# Altium schematic sheet Sheet1.SchDoc: Плата оконечного устройства
size 420 x 297 mm; ApprovedBy: Алексеев; CheckedBy: Богданов; Author: Пятиренко; DrawnBy: Пятиренко; DocumentNumber: ЭАЕСН.464512.003Э3; SheetNumber: 1; SheetTotal: 6; PERVICH PRIM: ЭАЕСН.464512.003; Title2: Схема электрическая принципиальная; DocumentName: Sheet1.SCHDOC; Application_BuildNumber: sdfsdfsdfsdfsdfs
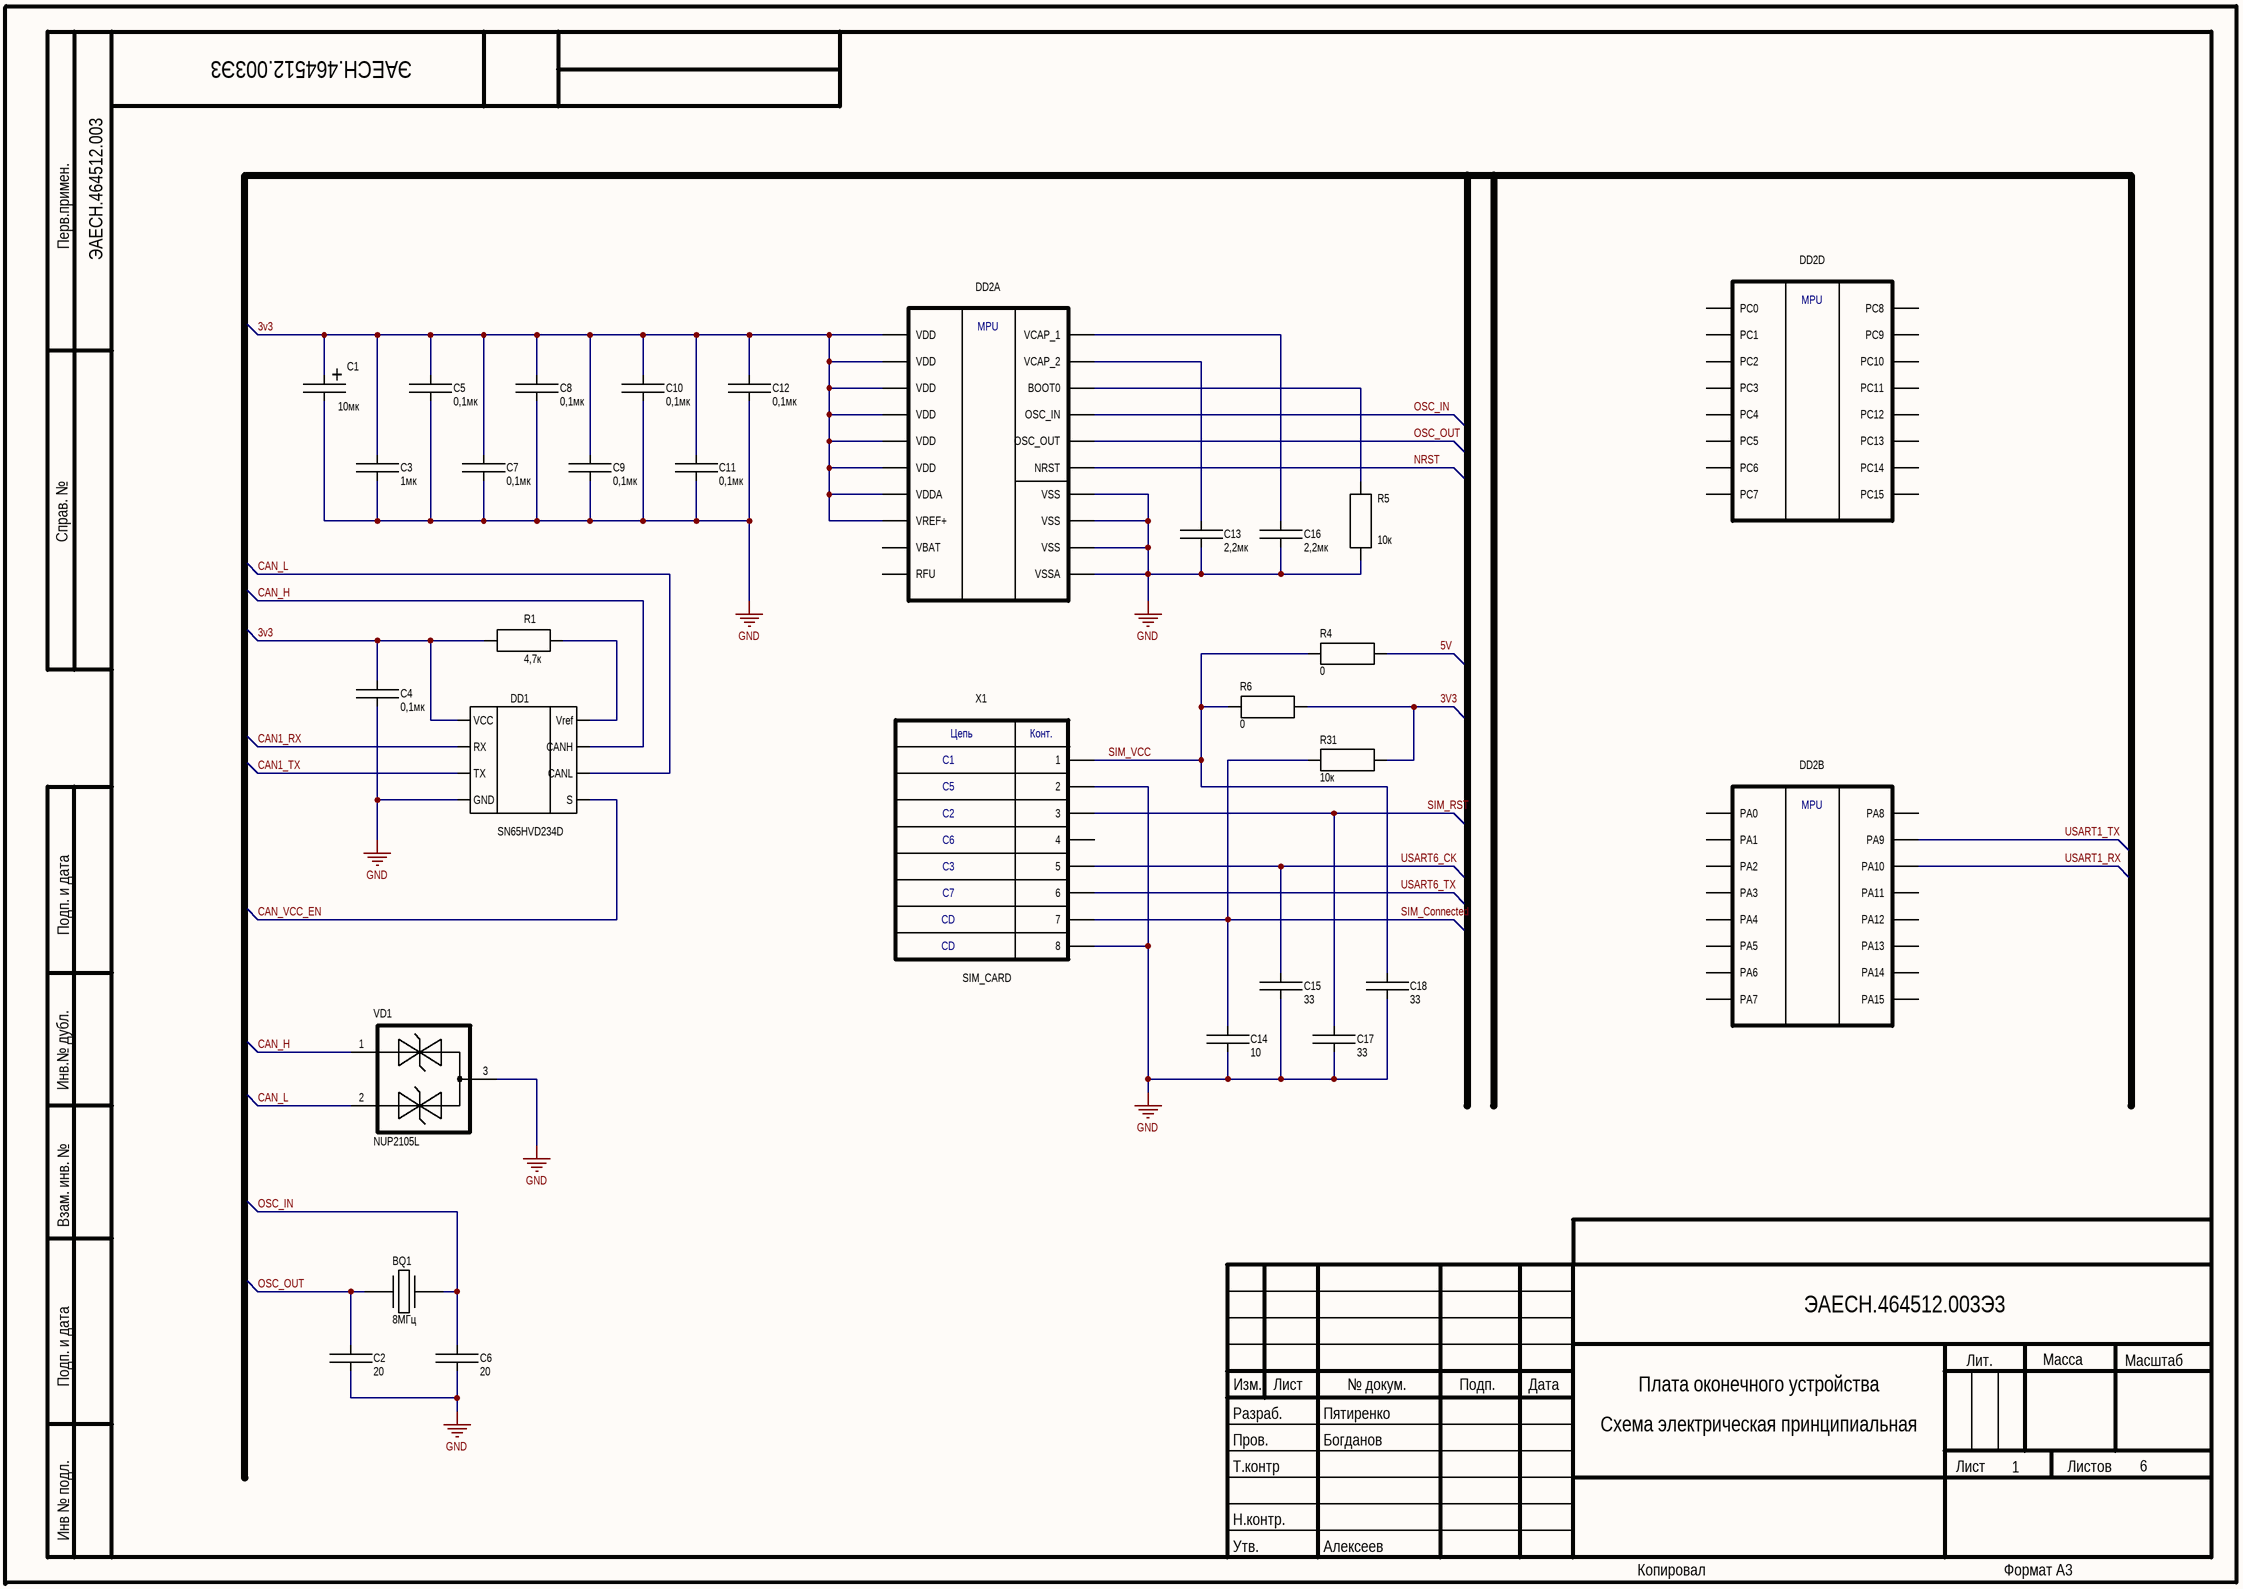
[diagram p0: Sheet1.SchDoc]

## Parts
BQ1  value 8МГц  [Crystal_0532]  (hidden comment: Quarz)
C1  value 10мк  [Case A]  (hidden comment: C_el)
C2  value 20  [С0603]  (hidden comment: C)
C3  value 1мк  [С0603]  (hidden comment: C)
C4  value 0,1мк  [С0603]  (hidden comment: C)
C5  value 0,1мк  [С0603]  (hidden comment: C)
C6  value 20  [С0603]  (hidden comment: C)
C7  value 0,1мк  [С0603]  (hidden comment: C)
C8  value 0,1мк  [С0603]  (hidden comment: C)
C9  value 0,1мк  [С0603]  (hidden comment: C)
C10  value 0,1мк  [С0603]  (hidden comment: C)
C11  value 0,1мк  [С0603]  (hidden comment: C)
C12  value 0,1мк  [С0603]  (hidden comment: C)
C13  value 2,2мк  [С0603]  (hidden comment: C)
C14  value 10  [С0603]  (hidden comment: C)
C15  value 33  [С0603]  (hidden comment: C)
C16  value 2,2мк  [С0603]  (hidden comment: C)
C17  value 33  [С0603]  (hidden comment: C)
C18  value 33  [С0603]  (hidden comment: C)
DD1  SN65HVD234D  [SOIC8]
DD2  STM32F207VCTx  [LQFP100]  (value not drawn)  (parts A,B,D of 6)
R1  value 4,7к  [R0603]  (hidden comment: R)
R4  value 0  [R0603]  (hidden comment: R)
R5  value 10к  [R0603]  (hidden comment: R)
R6  value 0  [R0603]  (hidden comment: R)
R31  value 10к  [R0603]  (hidden comment: R)
VD1  NUP2105L  [SOT-23]
X1  SIM_CARD  [SIM_CARD_READER2]

## Nets
GND: C1.2 C2.2 C3.2 C4.2 C5.2 C6.2 C7.2 C8.2 C9.2 C10.2 C11.2 C12.2 C13.2 C14.2 C15.2 C16.2 C17.2 C18.2 DD1.2(GND) DD2.10(VSS) DD2.20(VSSA) DD2.27(VSS) DD2.74(VSS) R5.2 VD1.3(AC) X1.2 X1.8
3v3: C1.1 C3.1 C4.1 C5.1 C7.1 C8.1 C9.1 C10.1 C11.1 C12.1 DD1.3(VCC) DD2.11(VDD) DD2.19(VDD) DD2.21(VREF+) DD2.22(VDDA) DD2.28(VDD) DD2.50(VDD) DD2.75(VDD) DD2.100(VDD) R1.1 R6.2 R31.2
5V: R4.2
CAN1_RX: DD1.4(RX)
CAN1_TX: DD1.1(TX)
CAN_H: DD1.7(CANH) VD1.1(A)
CAN_L: DD1.6(CANL) VD1.2(C)
CAN_VCC_EN: DD1.8(S)
NRST: DD2.14(NRST)
OSC_IN: BQ1.2 C6.1 DD2.12(OSC_IN)
OSC_OUT: BQ1.1 C2.1 DD2.13(OSC_OUT)
SIM_Connected: C14.1 R31.1 X1.7
SIM_RST: C17.1 X1.3
SIM_VCC: C18.1 R4.1 R6.1 X1.1
USART1_RX: DD2.69(PA10)
USART1_TX: DD2.68(PA9)
USART6_CK: C15.1 X1.5
USART6_TX: X1.6
NetC13_1: C13.1 DD2.73(VCAP_2)
NetC16_1: C16.1 DD2.49(VCAP_1)
NetDD1_5: DD1.5(Vref) R1.2
NetDD2_94: DD2.94(BOOT0) R5.1

Not connected (* = marked no-connect by the designer): DD2 6(VBAT) 7(PC13) 8(PC14) 9(PC15) 15(PC0) 16(PC1) 17(PC2) 18(PC3) 23(PA0) 24(PA1) 25(PA2) 26(PA3) 29(PA4) 30(PA5) 31(PA6) 32(PA7) 33(PC4) 34(PC5) 63(PC6) 64(PC7) 65(PC8) 66(PC9) 67(PA8) 70(PA11) 71(PA12) 72(PA13) 76(PA14) 77(PA15) 78(PC10) 79(PC11) 80(PC12) 99(RFU); X1 4

## Notes on the sheet
- Перв.примен.
- Справ. №
- Подп. и дата
- Инв.№ дубл.
- Взам. инв. №
- Изм.
- Лист
- № докум.
- Подп.
- Дата
- Лит.
- Масса
- Масштаб
- Пров.
- Т.контр
- Разраб.
- Листов
- Инв № подл.
- Н.контр.
- Утв.
- Копировал
- Формат А3
- (in symbol C_el) +
- (in symbol SIM_CARD) Цепь; Конт.; С1; С5; С2; С6; С3; C7; CD
- (in symbol STM32F207VCTx, part A) MPU
- (in symbol STM32F207VCTx, part B) MPU
- (in symbol STM32F207VCTx, part D) MPU